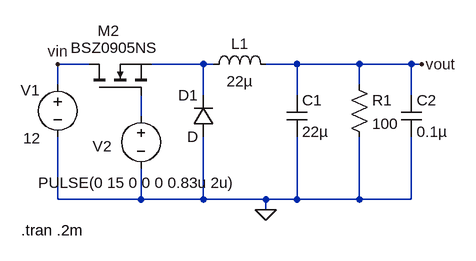
[diagram p0: schematic buck_converter.asc]
buck_converter.asc, the LTspice schematic file:
Version 4
SHEET 1 928 680
WIRE 16 144 -32 144
WIRE 192 144 112 144
WIRE 208 144 192 144
WIRE 336 144 288 144
WIRE 432 144 336 144
WIRE 512 144 432 144
WIRE 528 144 512 144
WIRE -32 176 -32 144
WIRE 432 176 432 144
WIRE 192 192 192 144
WIRE 336 192 336 144
WIRE 512 192 512 144
WIRE 96 224 96 192
WIRE -32 352 -32 256
WIRE 96 352 96 304
WIRE 96 352 -32 352
WIRE 192 352 192 256
WIRE 192 352 96 352
WIRE 288 352 192 352
WIRE 336 352 336 256
WIRE 336 352 288 352
WIRE 432 352 432 256
WIRE 432 352 336 352
WIRE 512 352 512 256
WIRE 512 352 432 352
WIRE 288 368 288 352
FLAG -32 144 vin
FLAG 528 144 vout
FLAG 288 368 0
SYMBOL ind 192 160 R270
WINDOW 0 32 56 VTop 2
WINDOW 3 5 56 VBottom 2
SYMATTR InstName L1
SYMATTR Value 22µ
SYMATTR SpiceLine Rser=1
SYMBOL cap 320 192 R0
SYMATTR InstName C1
SYMATTR Value 22µ
SYMBOL voltage -32 160 R0
WINDOW 123 0 0 Left 2
WINDOW 39 0 0 Left 2
WINDOW 0 -57 24 Left 2
WINDOW 3 -53 98 Left 2
SYMATTR InstName V1
SYMATTR Value 12
SYMBOL voltage 96 208 R0
WINDOW 0 -60 47 Top 2
WINDOW 3 -6 134 Bottom 2
WINDOW 123 0 0 Left 2
WINDOW 39 0 0 Left 2
SYMATTR InstName V2
SYMATTR Value PULSE(0 15 0 0 0 0.83u 2u)
SYMBOL res 416 160 R0
SYMATTR InstName R1
SYMATTR Value 100
SYMBOL diode 208 256 R180
WINDOW 0 24 64 Left 2
WINDOW 3 24 0 Left 2
SYMATTR InstName D1
SYMBOL cap 496 192 R0
SYMATTR InstName C2
SYMATTR Value 0.1µ
SYMBOL nmos 16 192 R270
WINDOW 0 99 13 VRight 2
WINDOW 3 73 -28 VRight 2
SYMATTR InstName M2
SYMATTR Value BSZ0905NS
TEXT -88 400 Left 2 !.tran .2m

The netlist it stands for:
* buck_converter.asc
L1 N001 vout 22µ Rser=1
C1 vout 0 22µ
V1 vin 0 12
V2 N002 0 PULSE(0 15 0 0 0 0.83u 2u)
R1 vout 0 100
D1 0 N001 D
C2 vout 0 0.1µ
M2 vin N002 N001 N001 BSZ0905NS
.model D D
.lib standard.dio
.model NMOS NMOS
.model PMOS PMOS
.lib standard.mos
.tran .2m
.backanno
.end